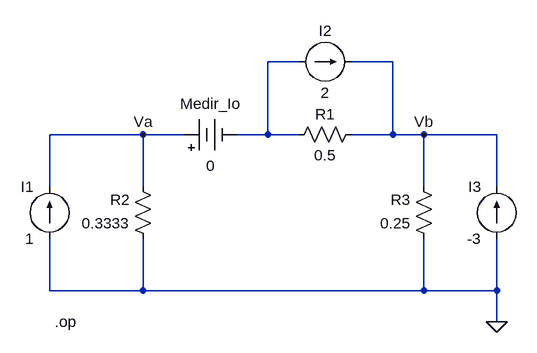
[diagram p0: schematic g3_p7.asc]
g3_p7.asc, the LTspice schematic file:
Version 4
SHEET 1 880 680
WIRE 176 16 128 16
WIRE 320 16 256 16
WIRE -64 128 -208 128
WIRE 0 128 -64 128
WIRE 128 128 128 16
WIRE 128 128 80 128
WIRE 176 128 128 128
WIRE 320 128 320 16
WIRE 320 128 256 128
WIRE 368 128 320 128
WIRE 480 128 368 128
WIRE -208 208 -208 128
WIRE -64 208 -64 128
WIRE 368 208 368 128
WIRE 480 208 480 128
WIRE -208 368 -208 288
WIRE -64 368 -64 288
WIRE -64 368 -208 368
WIRE 368 368 368 288
WIRE 368 368 -64 368
WIRE 480 368 480 288
WIRE 480 368 368 368
WIRE 480 416 480 368
FLAG 480 416 0
FLAG -64 128 Va
FLAG 368 128 Vb
SYMBOL res 272 112 R90
WINDOW 0 0 56 VBottom 2
WINDOW 3 32 56 VTop 2
SYMATTR InstName R1
SYMATTR Value 0.5
SYMBOL res -48 304 R180
WINDOW 0 36 76 Left 2
WINDOW 3 36 40 Left 2
SYMATTR InstName R2
SYMATTR Value 0.3333
SYMBOL res 384 304 R180
WINDOW 0 36 76 Left 2
WINDOW 3 36 40 Left 2
SYMATTR InstName R3
SYMATTR Value 0.25
SYMBOL current -208 288 R180
WINDOW 0 24 80 Left 2
WINDOW 3 24 0 Left 2
WINDOW 123 0 0 Left 0
WINDOW 39 0 0 Left 0
SYMATTR InstName I1
SYMATTR Value 1
SYMBOL current 176 16 R270
WINDOW 0 32 40 VTop 2
WINDOW 3 -32 40 VBottom 2
WINDOW 123 0 0 Left 0
WINDOW 39 0 0 Left 0
SYMATTR InstName I2
SYMATTR Value 2
SYMBOL current 480 288 R180
WINDOW 0 24 80 Left 2
WINDOW 3 24 0 Left 2
WINDOW 123 0 0 Left 0
WINDOW 39 0 0 Left 0
SYMATTR InstName I3
SYMATTR Value -3
SYMBOL Misc\\battery -16 128 R270
WINDOW 0 32 56 VTop 2
WINDOW 3 -32 56 VBottom 2
SYMATTR InstName Medir_Io
SYMATTR Value 0
TEXT -200 416 Left 2 !.op

The netlist it stands for:
* g3_p7.asc
R1 Vb N001 0.5
R2 0 Va 0.3333
R3 0 Vb 0.25
I1 0 Va 1
I2 N001 Vb 2
I3 0 Vb -3
V§Medir_Io Va N001 0
.op
.backanno
.end